# Altium project BT_STATUS_BOARD.PrjPcb
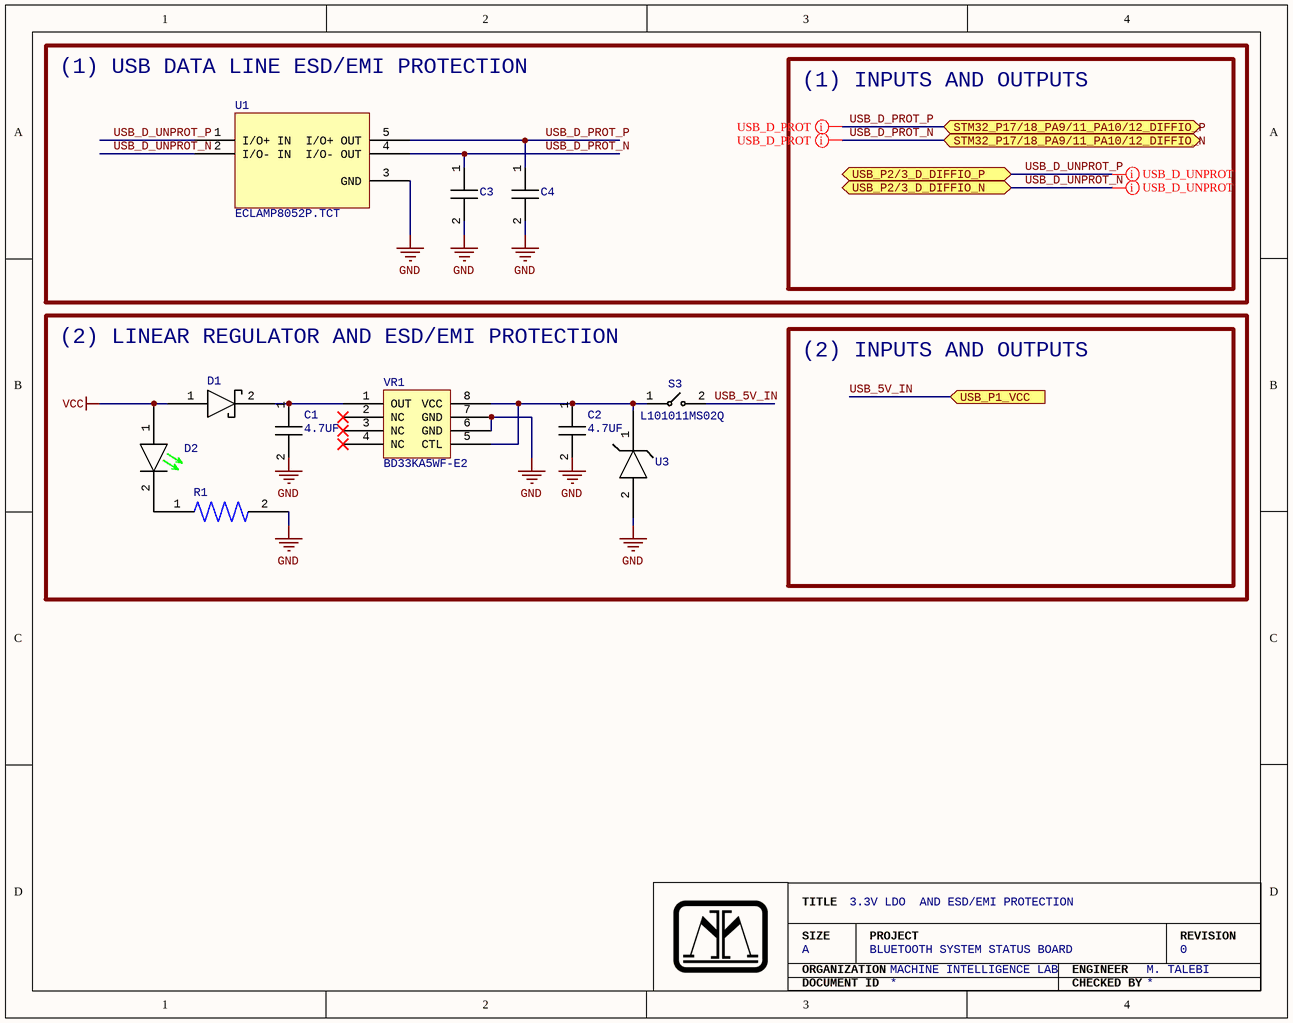
[diagram p0: S1 - POWER.SchDoc]
5 sheets, 41 parts. Net scope: flat (ports and power ports of the same name join across sheets).
Board file: P1 - PCB.PcbDoc
Sheets:
  S1 - POWER.SchDoc
  S2 - SWITCHES.SchDoc
  S3 - CONNECTORS.SchDoc
  S4 - MICROCONTROLLER.SchDoc
  S5 - BLUETOOTH.SchDoc

## Sheet S1 - POWER.SchDoc: 3.3V LDO  AND ESD/EMI PROTECTION
size A; PROJECT_NAME: BLUETOOTH STATUS BOARD; SHEET_TITLE: POWER MANAGEMENT SUBSYSTEMS; SIZE: A; DOCUMENT_ID: MIL-2021-ELEC-BTSTAT; CHECKED_BY: A. KUZMICKI; Parameter 1: 0; FIELD_1: BT BOARD POWER SUBSYSTEM; FIELD_2: A; FIELD_3: BLUETOOTH STATUS BOARD; FIELD_4: 0; FIELD_5: MACHINE INTELLIGENCE LAB; FIELD_6: M. TALEBI; FIELD_7: MIL-ELECTRICAL; FIELD_8: A. KUZMICKI; Engineer: M. TALEBI; Organization: MACHINE INTELLIGENCE LAB; Revision: 0; Project: BLUETOOTH SYSTEM STATUS BOARD

### Parts
C1  4.7UF  [TMK212AB7475KG-T]
C2  4.7UF  [TMK212AB7475KG-T]
C3  CC0603JRNPO8BN470  [CC0603JRNPO8BN470]  (value not drawn)
C4  CC0603JRNPO8BN470  [CC0603JRNPO8BN470]  (value not drawn)
D1  NRVB120VLSFT1G  [SODFL360X98-2N]  (value not drawn)
D2  151031VS06000  [151031VS06000]  (value not drawn)
R1  Y162440R0000B9R  [Y162440R0000B9R]  (value not drawn)
S3  L101011MS02Q  [L101011MS02Q]
U1  ECLAMP8052P.TCT  [ECLAMP8052P.TCT]
U3  UCLAMP0571P.TNT  [UCLAMP0571P.TNT]  (value not drawn)
VR1  BD33KA5WF-E2  [BD33KA5WF-E2]

### Ports
STM32_P17/18_PA9/11_PA10/12_DIFFIO_N (bidir), STM32_P17/18_PA9/11_PA10/12_DIFFIO_P (bidir), USB_P1_VCC (in), USB_P2/3_D_DIFFIO_N (bidir), USB_P2/3_D_DIFFIO_P (bidir)

### Nets
GND: C1.2 C2.2 C3.2 C4.2 R1.2 U1.3(GND) U3.2 VR1.6(GND) VR1.7(GND)
VCC: D1.1(-) D2.1(-)
USB_5V_IN: S3.2 ; port USB_P1_VCC
USB_D_PROT_N: C3.1 U1.4(I/O-_OUT) ; port STM32_P17/18_PA9/11_PA10/12_DIFFIO_N
USB_D_PROT_P: C4.1 U1.5(I/O+_OUT) ; port STM32_P17/18_PA9/11_PA10/12_DIFFIO_P
USB_D_UNPROT_N: U1.2(I/O-_IN) ; port USB_P2/3_D_DIFFIO_N
USB_D_UNPROT_P: U1.1(I/O+_IN) ; port USB_P2/3_D_DIFFIO_P
NetC1_1: C1.1 D1.2(+) VR1.1(OUT)
NetC2_1: C2.1 S3.1 U3.1 VR1.5(CTL) VR1.8(VCC)
NetD2_2: D2.2(+) R1.1

Not connected (* = marked no-connect by the designer): VR1 2(NC)* 3(NC)* 4(NC)*

### Layout directives
differential pair: USB_D_PROT_N, USB_D_PROT_P, USB_D_UNPROT_N, USB_D_UNPROT_P

### Notes on the sheet
- (1) USB DATA LINE ESD/EMI PROTECTION
- (1) INPUTS AND OUTPUTS
- (2) LINEAR REGULATOR AND ESD/EMI PROTECTION
- (2) INPUTS AND OUTPUTS
- TITLE
- SIZE
- ORGANIZATION
- A
- PROJECT
- ENGINEER
- REVISION
- DOCUMENT ID
- CHECKED BY

### Library data of the parts
C1 C2 = TMK212AB7475KG-T: CAP CER 4.7UF 25V X7R 0805; Tolerance: ±10%; Capacitance: 4.7 µF; Voltage - Rated: 25V; Temperature Coefficient: X7R; Operating Temperature: -55°C ~ 125°C; Applications: SMPS Filtering; Mounting Type: Surface Mount, MLCC; Package / Case: 0805 (2012 Metric); Size / Dimension: 0.079" L x 0.049" W (2.00mm x 1.25mm); Thickness (Max): 0.053" (1.35mm); ComponentLink1Description: Datasheet; ComponentLink1URL: https://www.yuden.co.jp/productdata/catalog/mlcc06_e.pdf; Supplier 1: Digi-Key; Supplier Part Number 1: 587-2990-1-ND
C3 C4 = CC0603JRNPO8BN470: CAP CER 47PF 25V NPO 0603; Tolerance: ±5%; Temperature Coefficient: C0G, NP0; Voltage - Rated: 25V; Operating Temperature: -55°C ~ 125°C; Applications: General Purpose; Mounting Type: Surface Mount, MLCC; Package / Case: 0603 (1608 Metric); Size / Dimension: 0.063" L x 0.031" W (1.60mm x 0.80mm); Thickness (Max): 0.035" (0.90mm); Capacitance: 47 pF; ComponentLink1Description: Datasheet; ComponentLink1URL: https://www.yageo.com/upload/media/product/productsearch/datasheet/mlcc/UPY-GP_NP0_16V-to-50V_18.pdf; Supplier 1: Digi-Key; Supplier Part Number 1: 311-3955-1-ND
D1 = NRVB120VLSFT1G: DIODE SCHOTTKY 20V 1A SOD123; Speed: Fast Recovery =< 500ns, > 200mA (Io); Voltage - Forward (Vf) (Max) @ If: 300 mV @ 1 A; Current - Reverse Leakage @ Vr: 15 mA @ 20 V; Diode Type: Schottky; Current - Average Rectified (Io): 1A; Mounting Type: Surface Mount; Package / Case: SOD-123F; Supplier Device Package: SOD-123FL; Operating Temperature - Junction: -65°C ~ 125°C; Voltage - DC Reverse (Vr) (Max): 20 V; Supplier 1: Future Electronics; Supplier Part Number 1: 3116510
D2 = 151031VS06000: LED GREEN DIFFUSED 3MM ROUND T/H; Configuration: Standard; Millicandela Rating: 30mcd; Lens Style: Round with Domed Top; Lens Size: 3.00mm Dia; Voltage - Forward (Vf) (Typ): 2.2V; Current - Test: 20mA; Viewing Angle: 60°; Wavelength - Dominant: 568nm; Wavelength - Peak: 560nm; Color: Green; Lens Color: Green; Lens Transparency: Diffused; Mounting Type: Through Hole; Package / Case: Radial; Supplier Device Package: 3mm Round; Height (Max): 5.55mm; Supplier 1: Digi-Key; Supplier Part Number 1: 732-5008-ND
R1 = Y162440R0000B9R: RES SMD 40 OHM 0.1% 1/5W 0805; Power (Watts): 0.2W, 1/5W; Temperature Coefficient: ±0.2ppm/°C; Resistance: 40 Ohms; Tolerance: ±0.1%; Composition: Metal Foil; Features: Moisture Resistant, Non-Inductive; Operating Temperature: -55°C ~ 150°C; Package / Case: 0805 (2012 Metric); Supplier Device Package: 0805; Size / Dimension: 0.080" L x 0.050" W (2.03mm x 1.27mm); Height - Seated (Max): 0.025" (0.64mm); Number of Terminations: 2; ComponentLink1Description: Datasheet; ComponentLink1URL: http://www.vishaypg.com/docs/63060/VSMP.pdf
S3 = L101011MS02Q: SWITCH SLIDE SPST 4A 125V; Contact Timing: Not Specified; Switch Function: On-Off; Current Rating (Amps): 4A (AC/DC); Actuator Type: Standard; Actuator Length: 5.08mm; Actuator Material: Polyamide (PA66), Nylon 6/6; Switch Travel: 3.81mm; Electrical Life: 10,000 Cycles; Voltage Rating - DC: 28 V; Circuit: SPST; Contact Material: Copper; Contact Finish: Silver; Mounting Type: Through Hole; Termination Style: PC Pin; Operating Temperature: -30°C ~ 65°C; Voltage Rating - AC: 125 V; ComponentLink1Description: Datasheet; ComponentLink1URL: https://www.ckswitches.com/media/1423/l.pdf; Supplier 1: Digi-Key; Supplier Part Number 1: CKC5106-ND
U1 = ECLAMP8052P.TCT: CMC 2LN SMD ESD AEC-Q100; Number of Lines: 2; DC Resistance (DCR) (Max): 1.8Ohm; Operating Temperature: -40°C ~ 125°C; Ratings: AEC-Q100; Features: ESD; Mounting Type: Surface Mount; Size / Dimension: 0.075" L x 0.067" W (1.90mm x 1.70mm); Height (Max): 0.024" (0.60mm); Package / Case: 5-UFDFN; ComponentLink1Description: Datasheet; ComponentLink1URL: https://semtech.my.salesforce.com/sfc/p/#E0000000JelG/a/44000000MClt/x4_O.M8f1_5l6CovuR7Nj9RxqDFB_sAgVeqN73g7pps; Supplier 1: Digi-Key; Supplier Part Number 1: ECLAMP8052P.TCTCT-ND
U3 = UCLAMP0571P.TNT: TVS DIODE 5V 15V SGP1610N2; Voltage - Reverse Standoff (Typ): 5V (Max); Voltage - Breakdown (Min): 6V; Current - Peak Pulse (10/1000µs): 80A; Power Line Protection: No; Capacitance @ Frequency: 675pF @ 1MHz; Unidirectional Channels: 1; Type: Zener; Voltage - Clamping (Max) @ Ipp: 15V; Applications: Automotive; Operating Temperature: -40°C ~ 125°C (TJ); Mounting Type: Surface Mount; Package / Case: 2-UDFN; Supplier Device Package: SGP1610N2; Supplier 1: Digi-Key; Supplier Part Number 1: UCLAMP0571P.TNTCT-ND; ComponentLink1Description: Datasheet; ComponentLink1URL: https://semtech.my.salesforce.com/sfc/p/#E0000000JelG/a/440000001MYJ/IUMjL3gSEdL0j_8aQaHuKPXW_0n5uJ8aCJSLGDAHDuk
VR1 = BD33KA5WF-E2: IC REG LINEAR 3.3V 500MA 8SOP; Output Configuration: Positive; Output Type: Fixed; Voltage - Input (Max): 5.5V; Voltage Dropout (Max): 0.2V @ 200mA; PSRR: 50dB (120Hz); Control Features: Enable; Protection Features: Over Current, Over Temperature; Number of Regulators: 1; Current - Quiescent (Iq): 550 µA; Voltage - Output (Min/Fixed): 3.3V; Current - Output: 500mA; Operating Temperature: -40°C ~ 105°C; Mounting Type: Surface Mount; Package / Case: 8-SOIC (0.173", 4.40mm Width); Supplier Device Package: 8-SOP; Current - Supply (Max): 550 µA; Supplier 1: Digi-Key; Supplier Part Number 1: BD33KA5WF-E2CT-ND

## Sheet S2 - SWITCHES.SchDoc: DEBOUNCED SWITCH CONFIGURATIONS
size A; FIELD_1: 1; FIELD_2: 2; FIELD_3: 3; FIELD_4: 4; FIELD_5: 5; FIELD_6: 6; FIELD_7: 7; FIELD_8: 8; Engineer: M. TALEBI; Organization: MACHINE INTELLIGENCE LAB; Revision: 0; Project: BLUETOOTH SYSTEM STATUS BOARD
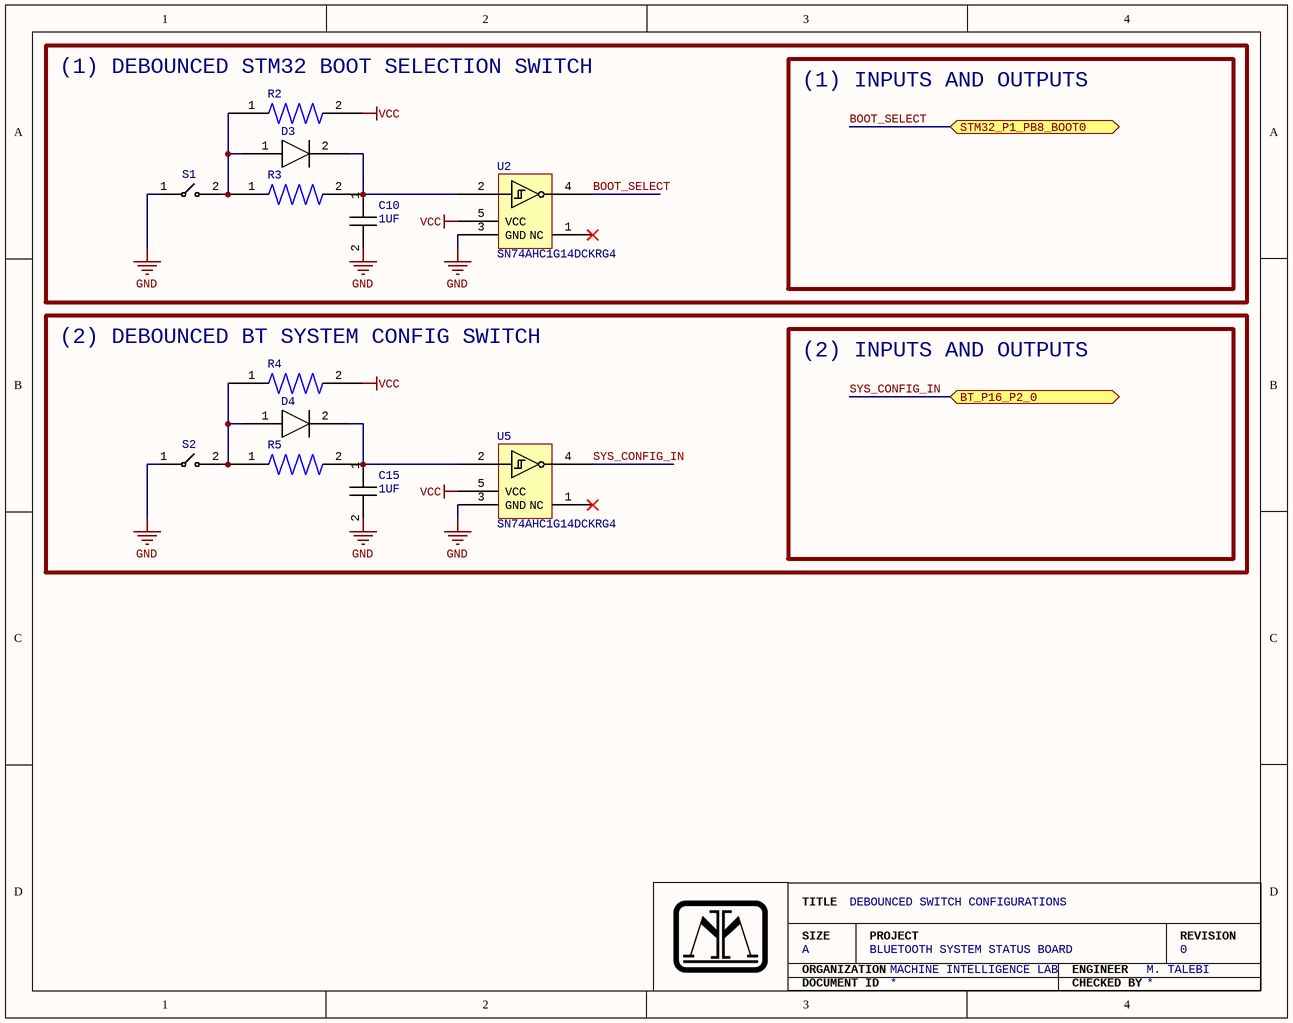
[diagram p1: S2 - SWITCHES.SchDoc]

### Parts
C10  1UF  [CL10A105KQ8NNNC]
C15  1UF  [CL10A105KQ8NNNC]
D3  RS1K-13-F  [RS1K-13-F]  (value not drawn)
D4  RS1K-13-F  [RS1K-13-F]  (value not drawn)
R2  RT1206BRD0740KL  [RT1206BRD0740KL]  (value not drawn)
R3  RT1206BRD0740KL  [RT1206BRD0740KL]  (value not drawn)
R4  RT1206BRD0740KL  [RT1206BRD0740KL]  (value not drawn)
R5  RT1206BRD0740KL  [RT1206BRD0740KL]  (value not drawn)
S1  L101011MS02Q  [L101011MS02Q]  (value not drawn)
S2  L101011MS02Q  [L101011MS02Q]  (value not drawn)
U2  SN74AHC1G14DCKRG4  [SN74AHC1G14DCKRG4]
U5  SN74AHC1G14DCKRG4  [SN74AHC1G14DCKRG4]

### Ports
BT_P16_P2_0 (bidir), STM32_P1_PB8_BOOT0 (bidir)

### Nets
GND: C10.2 C15.2 S1.1 S2.1 U2.3(GND) U5.3(GND)
VCC: R2.2 R4.2 U2.5(VCC) U5.5(VCC)
BOOT_SELECT: U2.4 ; port STM32_P1_PB8_BOOT0
SYS_CONFIG_IN: U5.4 ; port BT_P16_P2_0
NetC10_1: C10.1 D3.2(+) R3.2 U2.2
NetC15_1: C15.1 D4.2(+) R5.2 U5.2
NetD3_1: D3.1(-) R2.1 R3.1 S1.2
NetD4_1: D4.1(-) R4.1 R5.1 S2.2

Not connected (* = marked no-connect by the designer): U2 1(NC)*; U5 1(NC)*

### Notes on the sheet
- (near R2) (1) DEBOUNCED STM32 BOOT SELECTION SWITCH
- (1) INPUTS AND OUTPUTS
- (near R4) (2) DEBOUNCED BT SYSTEM CONFIG SWITCH
- (2) INPUTS AND OUTPUTS
- TITLE
- SIZE
- ORGANIZATION
- A
- PROJECT
- ENGINEER
- REVISION
- DOCUMENT ID
- CHECKED BY

### Library data of the parts
C10 C15 = CL10A105KQ8NNNC: CAP CER 1UF 6.3V X5R 0603; Tolerance: ±10%; Capacitance: 1 µF; Voltage - Rated: 6.3V; Temperature Coefficient: X5R; Operating Temperature: -55°C ~ 85°C; Applications: General Purpose; Mounting Type: Surface Mount, MLCC; Package / Case: 0603 (1608 Metric); Size / Dimension: 0.063" L x 0.031" W (1.60mm x 0.80mm); Thickness (Max): 0.035" (0.90mm); Supplier 1: Digi-Key; Supplier Part Number 1: 1276-1036-1-ND; ComponentLink1Description: Datasheet; ComponentLink1URL: https://www.samsungsem.com/resources/file/global/support/product_catalog/MLCC.pdf
D3 D4 = RS1K-13-F: DIODE GEN PURP 800V 1A SMA; Diode Type: Standard; Speed: Fast Recovery =< 500ns, > 200mA (Io); Capacitance @ Vr, F: 15pF @ 4V, 1MHz; Reverse Recovery Time (trr): 500 ns; Voltage - Forward (Vf) (Max) @ If: 1.3 V @ 1 A; Current - Reverse Leakage @ Vr: 5 µA @ 800 V; Current - Average Rectified (Io): 1A; Mounting Type: Surface Mount; Package / Case: DO-214AC, SMA; Supplier Device Package: SMA; Operating Temperature - Junction: -65°C ~ 150°C; Voltage - DC Reverse (Vr) (Max): 800 V; ComponentLink1Description: Datasheet; ComponentLink1URL: https://www.diodes.com/assets/Datasheets/ds15002.pdf
R2-R5 = RT1206BRD0740KL: RES SMD 40K OHM 0.1% 1/4W 1206; Power (Watts): 0.25W, 1/4W; Temperature Coefficient: ±25ppm/°C; Resistance: 40 kOhms; Tolerance: ±0.1%; Composition: Thin Film; Operating Temperature: -55°C ~ 155°C; Package / Case: 1206 (3216 Metric); Supplier Device Package: 1206; Size / Dimension: 0.122" L x 0.063" W (3.10mm x 1.60mm); Height - Seated (Max): 0.026" (0.65mm); Number of Terminations: 2; ComponentLink1Description: Datasheet; ComponentLink1URL: https://www.yageo.com/upload/media/product/productsearch/datasheet/rchip/PYu-RT_1-to-0.01_RoHS_L_12.pdf; Supplier 1: Digi-Key; Supplier Part Number 1: 13-RT1206BRD0740KLCT-ND
S1 S2 = L101011MS02Q: as S3 on sheet S1 - POWER; Circuit: SPST; Contact Material: Copper; Contact Finish: Silver; Mounting Type: Through Hole; Termination Style: PC Pin; Operating Temperature: -30°C ~ 65°C; Voltage Rating - AC: 125 V; ComponentLink1Description: Datasheet; ComponentLink1URL: https://www.ckswitches.com/media/1423/l.pdf; Supplier 1: Digi-Key; Supplier Part Number 1: CKC5106-ND
U2 U5 = SN74AHC1G14DCKRG4: IC INVERT SCHMITT 1CH 1IN SC70; Logic Type: Inverter; Number of Inputs: 1; Voltage - Supply: 2V ~ 5.5V; Current - Output High, Low: 8mA, 8mA; Logic Level - Low: 0.9V ~ 1.65V; Logic Level - High: 2.2V ~ 3.85V; Max Propagation Delay @ V, Max CL: 10.6ns @ 5V, 50pF; Current - Quiescent (Max): 1 µA; Features: Schmitt Trigger; Operating Temperature: -40°C ~ 125°C; Mounting Type: Surface Mount; Supplier Device Package: SC-70-5; Package / Case: 5-TSSOP, SC-70-5, SOT-353; Number of Circuits: 1

## Sheet S3 - CONNECTORS.SchDoc: CONNECTORS AND HEADERS
size A; FIELD_1: 1; FIELD_2: 2; FIELD_3: 3; FIELD_4: 4; FIELD_5: 5; FIELD_6: 6; FIELD_7: 7; FIELD_8: 8; Engineer: M. TALEBI; Organization: MACHINE INTELLIGENCE LAB; Revision: 0; Project: BLUETOOTH SYSTEM STATUS BOARD
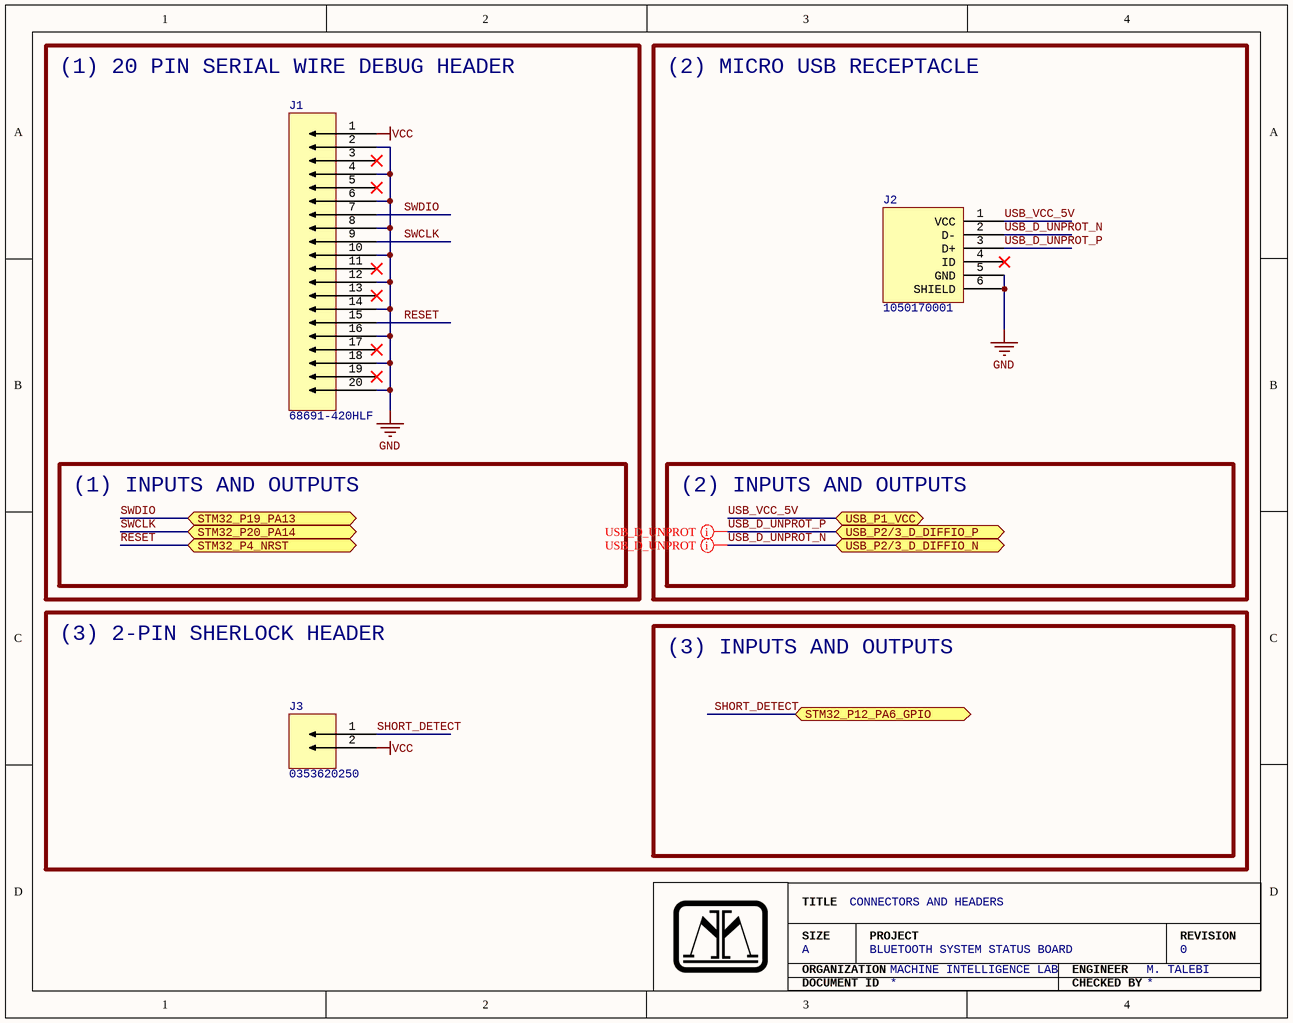
[diagram p2: S3 - CONNECTORS.SchDoc]

### Parts
J1  68691-420HLF  [68691-420HLF]
J2  1050170001  [1050170001]
J3  0353620250  [0353620250]

### Ports
STM32_P4_NRST (bidir), STM32_P12_PA6_GPIO (bidir), STM32_P19_PA13 (bidir), STM32_P20_PA14 (bidir), USB_P1_VCC (bidir), USB_P2/3_D_DIFFIO_N (bidir), USB_P2/3_D_DIFFIO_P (bidir)

### Nets
GND: J1.2 J1.4 J1.6 J1.8 J1.10 J1.12 J1.14 J1.16 J1.18 J1.20 J2.5(GND) J2.6(SHIELD)
VCC: J1.1 J3.2
RESET: J1.15 ; port STM32_P4_NRST
SHORT_DETECT: J3.1 ; port STM32_P12_PA6_GPIO
SWCLK: J1.9 ; port STM32_P20_PA14
SWDIO: J1.7 ; port STM32_P19_PA13
USB_D_UNPROT_N: J2.2(D-) ; port USB_P2/3_D_DIFFIO_N
USB_D_UNPROT_P: J2.3(D+) ; port USB_P2/3_D_DIFFIO_P
USB_VCC_5V: J2.1(VCC) ; port USB_P1_VCC  [project net USB_5V_IN]

Not connected (* = marked no-connect by the designer): J1 3(36)* 5(38)* 11(44)* 13(46)* 17(50)* 19(52)*; J2 4(ID)*

### Layout directives
differential pair: USB_D_UNPROT_N, USB_D_UNPROT_P

### Notes on the sheet
- (1) 20 PIN SERIAL WIRE DEBUG HEADER
- (2) MICRO USB RECEPTACLE
- (1) INPUTS AND OUTPUTS
- (2) INPUTS AND OUTPUTS
- (3) 2-PIN SHERLOCK HEADER
- (3) INPUTS AND OUTPUTS
- TITLE
- SIZE
- ORGANIZATION
- A
- PROJECT
- ENGINEER
- REVISION
- DOCUMENT ID
- CHECKED BY

### Library data of the parts
J1 = 68691-420HLF: CONN HEADER VERT 20POS 2.54MM; Pitch - Mating: 0.100" (2.54mm); Number of Positions: 20; Number of Positions Loaded: All; Style: Board to Board; Shrouding: Unshrouded; Contact Length - Mating: 0.318" (8.08mm); Contact Length - Post: 0.120" (3.05mm); Overall Contact Length: 0.538" (13.67mm); Material Flammability Rating: UL94 V-0; Connector Type: Header; Contact Type: Male Pin; Number of Rows: 2; Row Spacing - Mating: 0.100" (2.54mm); Mounting Type: Through Hole; Termination: Solder; Fastening Type: Push-Pull; Insulation Height: 0.100" (2.54mm); Contact Shape: Square; Contact Finish - Mating: Tin; Contact Finish Thickness - Mating: 100.0µin (2.54µm); Contact Finish - Post: Tin; Contact Material: Phosphor Bronze; Insulation Color: Black; Supplier 1: Digi-Key; Supplier Part Number 1: 609-6378-ND
J2 = 1050170001: CONN RCPT USB2.0 MICRO B SMD R/A; Connector Type: USB - micro B; Number of Contacts: 5; Gender: Receptacle; Current Rating (Amps): 1A, 1.8A; Voltage - Rated: 30VAC; Mating Cycles: 10000; Shielding: Shielded; Material Flammability Rating: UL94 V-0; Number of Ports: 1; Specifications: USB 2.0; Mounting Type: Surface Mount, Right Angle; Through Hole; Mounting Feature: Horizontal; Termination: Solder; Features: Pick and Place, Solder Retention; Operating Temperature: -30°C ~ 85°C; Contact Finish: Gold; Shell/Shielding Material: Steel, Stainless; Insulation Color: Black; Supplier 1: Digi-Key; Supplier Part Number 1: WM1399CT-ND
J3 = 0353620250: CONN HEADER VERT 2POS 2MM; Pitch - Mating: 0.079" (2.00mm); Number of Positions: 2; Number of Positions Loaded: All; Style: Board to Cable/Wire; Shrouding: Shrouded - 4 Wall; Contact Length - Mating: 0.145" (3.70mm); Contact Length - Post: 0.130" (3.30mm); Material Flammability Rating: UL94 V-0; Voltage Rating: 125V; Mated Stacking Heights: 8.5mm; Connector Type: Header; Contact Type: Male Pin; Number of Rows: 1; Mounting Type: Through Hole; Termination: Solder; Fastening Type: Locking Ramp; Insulation Height: 0.335" (8.51mm); Contact Shape: Square; Contact Finish - Mating: Tin; Contact Finish Thickness - Mating: 39.4µin (1.00µm); Contact Finish - Post: Tin; Contact Material: Brass; Insulation Material: Polyamide (PA), Nylon; Operating Temperature: -40°C ~ 105°C; Insulation Color: Natural; Contact Finish Thickness - Post: 39.4µin (1.00µm); Applications: Automotive, General Purpose; ComponentLink1Description: Datasheet; ComponentLink1URL: https://media.digikey.com/pdf/Data%20Sheets/Molex%20PDFs/PS-35507-003.pdf

## Sheet S4 - MICROCONTROLLER.SchDoc: STM32 MCU
size A; FIELD_1: 1; FIELD_2: 2; FIELD_3: 3; FIELD_4: 4; FIELD_5: 5; FIELD_6: 6; FIELD_7: 7; FIELD_8: 8; Engineer: M. TALEBI; Organization: MACHINE INTELLIGENCE LAB; Revision: 0; Project: BLUETOOTH SYSTEM STATUS BOARD
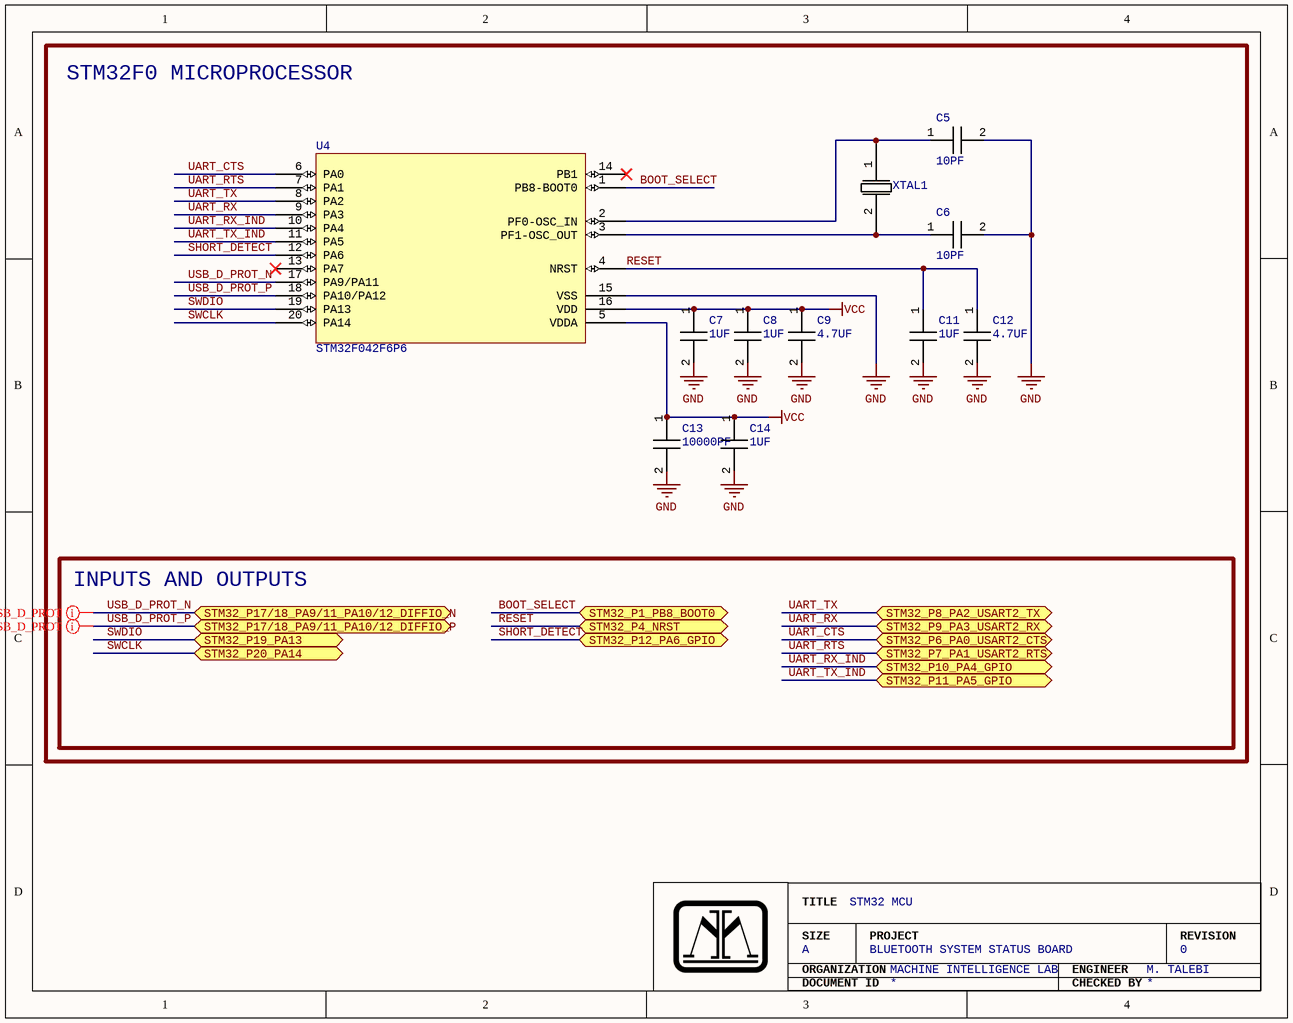
[diagram p3: S4 - MICROCONTROLLER.SchDoc]

### Parts
C5  10PF  [C0603C0G1E100D030BA]
C6  10PF  [C0603C0G1E100D030BA]
C7  1UF  [CL10A105KQ8NNNC]
C8  1UF  [CL10A105KQ8NNNC]
C9  4.7UF  [TMK212AB7475KG-T]
C11  1UF  [CL10A105KQ8NNNC]
C12  4.7UF  [TMK212AB7475KG-T]
C13  10000PF  [C1005X7R1C103K050BA]
C14  1UF  [CL10A105KQ8NNNC]
U4  STM32F042F6P6  [STM32F042F6P6]
XTAL1  ECS-80-20-5PX-TR  [ECS-80-20-5PX-TR]  (value not drawn)

### Ports
STM32_P1_PB8_BOOT0 (bidir), STM32_P4_NRST (bidir), STM32_P6_PA0_USART2_CTS (bidir), STM32_P7_PA1_USART2_RTS (bidir), STM32_P8_PA2_USART2_TX (bidir), STM32_P9_PA3_USART2_RX (bidir), STM32_P10_PA4_GPIO (bidir), STM32_P11_PA5_GPIO (bidir), STM32_P12_PA6_GPIO (bidir), STM32_P17/18_PA9/11_PA10/12_DIFFIO_N (bidir), STM32_P17/18_PA9/11_PA10/12_DIFFIO_P (bidir), STM32_P19_PA13 (bidir), STM32_P20_PA14 (bidir)

### Nets
GND: C5.2 C6.2 C7.2 C8.2 C9.2 C11.2 C12.2 C13.2 C14.2 U4.15(VSS)
VCC: C7.1 C8.1 C9.1 C13.1 C14.1 U4.5(VDDA) U4.16(VDD)
BOOT_SELECT: U4.1(PB8-BOOT0) ; port STM32_P1_PB8_BOOT0
RESET: C11.1 C12.1 U4.4(NRST) ; port STM32_P4_NRST
SHORT_DETECT: U4.12(PA6) ; port STM32_P12_PA6_GPIO
SWCLK: U4.20(PA14) ; port STM32_P20_PA14
SWDIO: U4.19(PA13) ; port STM32_P19_PA13
UART_CTS: U4.6(PA0) ; port STM32_P6_PA0_USART2_CTS
UART_RTS: U4.7(PA1) ; port STM32_P7_PA1_USART2_RTS
UART_RX: U4.9(PA3) ; port STM32_P9_PA3_USART2_RX
UART_RX_IND: U4.10(PA4) ; port STM32_P10_PA4_GPIO
UART_TX: U4.8(PA2) ; port STM32_P8_PA2_USART2_TX
UART_TX_IND: U4.11(PA5) ; port STM32_P11_PA5_GPIO
USB_D_PROT_N: U4.17(PA9/PA11) ; port STM32_P17/18_PA9/11_PA10/12_DIFFIO_N
USB_D_PROT_P: U4.18(PA10/PA12) ; port STM32_P17/18_PA9/11_PA10/12_DIFFIO_P
NetC5_1: C5.1 U4.2(PF0-OSC_IN) XTAL1.1
NetC6_1: C6.1 U4.3(PF1-OSC_OUT) XTAL1.2

Not connected (* = marked no-connect by the designer): U4 13(PA7)* 14(PB1)*

### Layout directives
differential pair: USB_D_PROT_N, USB_D_PROT_P

### Notes on the sheet
- STM32F0 MICROPROCESSOR
- INPUTS AND OUTPUTS
- TITLE
- SIZE
- ORGANIZATION
- A
- PROJECT
- ENGINEER
- REVISION
- DOCUMENT ID
- CHECKED BY

### Library data of the parts
C5 C6 = C0603C0G1E100D030BA: CAP CER 10PF 25V C0G 0201; Tolerance: ±0.5pF; Temperature Coefficient: C0G, NP0; Voltage - Rated: 25V; Operating Temperature: -55°C ~ 125°C; Features: Low ESL; Applications: General Purpose; Mounting Type: Surface Mount, MLCC; Package / Case: 0201 (0603 Metric); Size / Dimension: 0.024" L x 0.012" W (0.60mm x 0.30mm); Thickness (Max): 0.013" (0.33mm); Capacitance: 10 pF; ComponentLink1Description: Datasheet; ComponentLink1URL: https://product.tdk.com/en/system/files?file=dam/doc/product/capacitor/ceramic/mlcc/catalog/mlcc_commercial_general_en.pdf; Supplier 1: Digi-Key; Supplier Part Number 1: 445-4651-1-ND
C7 C8 C11 C14 = CL10A105KQ8NNNC: as C10 on sheet S2 - SWITCHES; Voltage - Rated: 6.3V; Temperature Coefficient: X5R; Operating Temperature: -55°C ~ 85°C; Applications: General Purpose; Mounting Type: Surface Mount, MLCC; Package / Case: 0603 (1608 Metric); Size / Dimension: 0.063" L x 0.031" W (1.60mm x 0.80mm); Thickness (Max): 0.035" (0.90mm); Supplier 1: Digi-Key; Supplier Part Number 1: 1276-1036-1-ND; ComponentLink1Description: Datasheet; ComponentLink1URL: https://www.samsungsem.com/resources/file/global/support/product_catalog/MLCC.pdf
C9 C12 = TMK212AB7475KG-T: as C1 on sheet S1 - POWER; Voltage - Rated: 25V; Temperature Coefficient: X7R; Operating Temperature: -55°C ~ 125°C; Applications: SMPS Filtering; Mounting Type: Surface Mount, MLCC; Package / Case: 0805 (2012 Metric); Size / Dimension: 0.079" L x 0.049" W (2.00mm x 1.25mm); Thickness (Max): 0.053" (1.35mm); ComponentLink1Description: Datasheet; ComponentLink1URL: https://www.yuden.co.jp/productdata/catalog/mlcc06_e.pdf; Supplier 1: Digi-Key; Supplier Part Number 1: 587-2990-1-ND
C13 = C1005X7R1C103K050BA: CAP CER 10000PF 16V X7R 0402; Tolerance: ±10%; Voltage - Rated: 16V; Temperature Coefficient: X7R; Operating Temperature: -55°C ~ 125°C; Features: Low ESL; Applications: General Purpose; Mounting Type: Surface Mount, MLCC; Package / Case: 0402 (1005 Metric); Size / Dimension: 0.039" L x 0.020" W (1.00mm x 0.50mm); Thickness (Max): 0.022" (0.55mm); Capacitance: 10000 pF; ComponentLink1Description: Datasheet; ComponentLink1URL: https://product.tdk.com/en/system/files?file=dam/doc/product/capacitor/ceramic/mlcc/catalog/mlcc_commercial_general_en.pdf; Supplier 1: Digi-Key; Supplier Part Number 1: 445-1262-1-ND
U4 = STM32F042F6P6: IC MCU 32BIT 32KB FLASH 20TSSOP; Core Processor: ARM® Cortex®-M0; Speed: 48MHz; Connectivity: CANbus, HDMI-CEC, I²C, IrDA, LINbus, SPI, UART/USART, USB; Peripherals: DMA, I²S, POR, PWM, WDT; Program Memory Size: 32KB (32K x 8); RAM Size: 6K x 8; Voltage - Supply (Vcc/Vdd): 1.65V ~ 3.6V; Data Converters: A/D 12x12b; Oscillator Type: Internal; Number of I/O: 16; Core Size: 32-Bit; Supplier Part Number 1: 42Y1015; Program Memory Type: FLASH; Operating Temperature: -40°C ~ 85°C (TA); Mounting Type: Surface Mount; Package / Case: 20-TSSOP (0.173", 4.40mm Width); Supplier Device Package: 20-TSSOP; Supplier 1: Newark; ComponentLink1Description: Datasheet; ComponentLink1URL: https://www.st.com/content/ccc/resource/technical/document/datasheet/52/ad/d0/80/e6/be/40/ad/DM00105814.pdf/files/DM00105814.pdf/jcr:content/translations/en.DM00105814.pdf
XTAL1 = ECS-80-20-5PX-TR: CRYSTAL 8.0000MHZ 20PF SMD; Frequency Stability: ±50ppm; Frequency Tolerance: ±30ppm; Operating Mode: Fundamental; Frequency: 8 MHz; ESR (Equivalent Series Resistance): 60 Ohms; Type: MHz Crystal; Load Capacitance: 20pF; Operating Temperature: -10°C ~ 70°C; Mounting Type: Surface Mount; Package / Case: HC-49/US; Size / Dimension: 0.449" L x 0.189" W (11.40mm x 4.80mm); Height - Seated (Max): 0.169" (4.30mm); ComponentLink1Description: Datasheet; ComponentLink1URL: https://ecsxtal.com/store/pdf/csm-7x.pdf

## Sheet S5 - BLUETOOTH.SchDoc: BLUETOOTH MODULE
size A; FIELD_1: 1; FIELD_2: 2; FIELD_3: 3; FIELD_4: 4; FIELD_5: 5; FIELD_6: 6; FIELD_7: 7; FIELD_8: 8; Engineer: M. TALEBI; Organization: MACHINE INTELLIGENCE LAB; Revision: 0; Project: BLUETOOTH SYSTEM STATUS BOARD
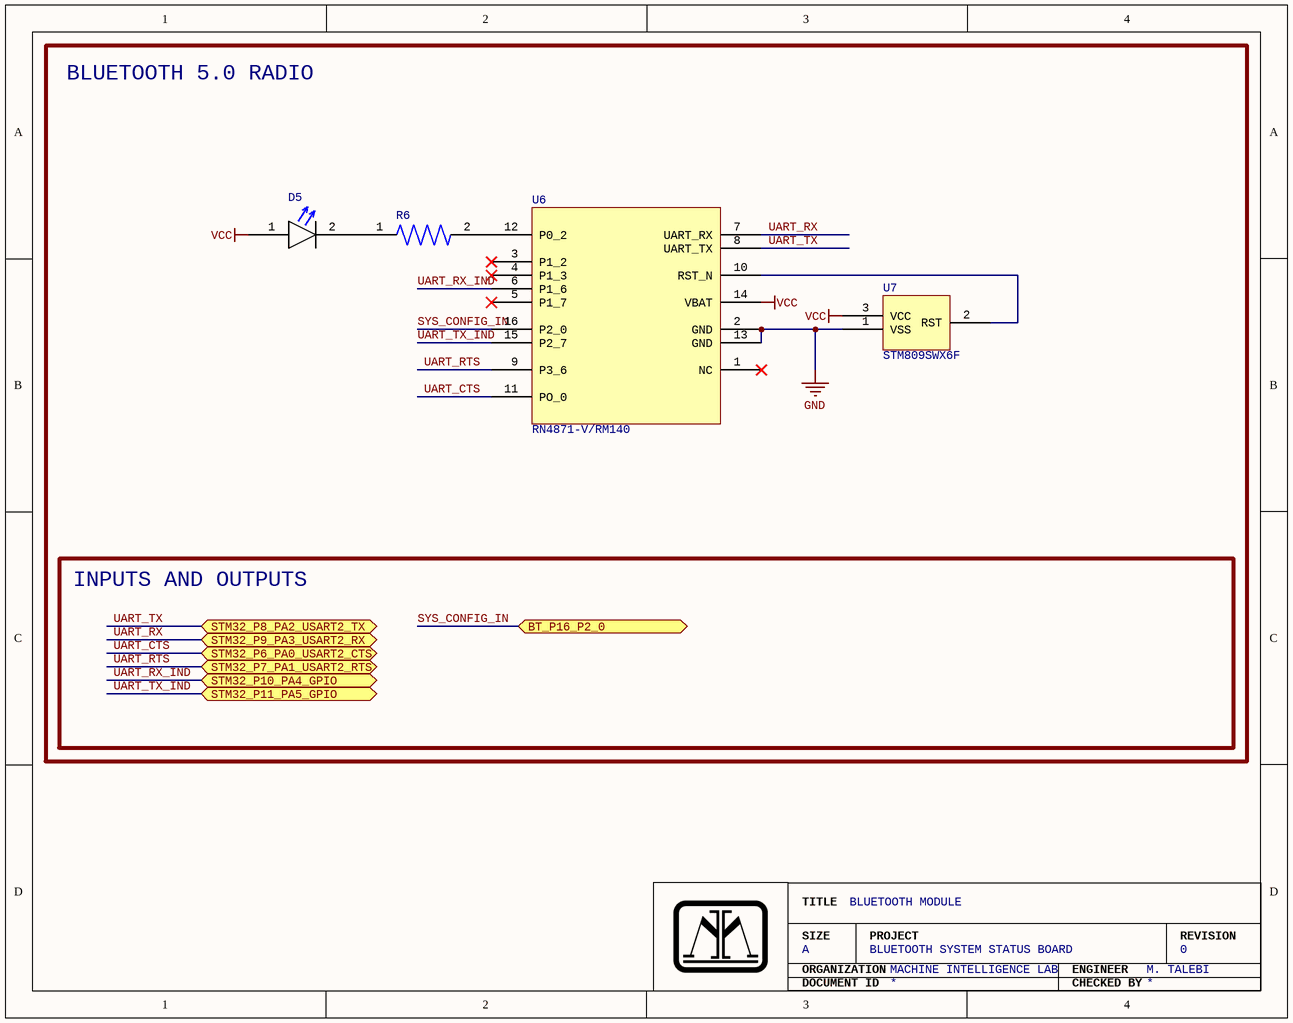
[diagram p4: S5 - BLUETOOTH.SchDoc]

### Parts
D5  SLR343BC4T3F  [SLR343BC4T3F]  (value not drawn)
R6  CRCW0201330RFKED  [CRCW0201330RFKED]  (value not drawn)
U6  RN4871-V/RM140  [RN4871-V/RM140]
U7  STM809SWX6F  [STM809SWX6F]

### Ports
BT_P16_P2_0 (bidir), STM32_P6_PA0_USART2_CTS (bidir), STM32_P7_PA1_USART2_RTS (bidir), STM32_P8_PA2_USART2_TX (bidir), STM32_P9_PA3_USART2_RX (bidir), STM32_P10_PA4_GPIO (bidir), STM32_P11_PA5_GPIO (bidir)

### Nets
GND: U6.2(GND) U6.13(GND) U7.1(VSS)
VCC: D5.1(-) U6.14(VBAT) U7.3(VCC)
SYS_CONFIG_IN: U6.16(P2_0) ; port BT_P16_P2_0
UART_CTS: U6.11(PO_0) ; port STM32_P6_PA0_USART2_CTS
UART_RTS: U6.9(P3_6) ; port STM32_P7_PA1_USART2_RTS
UART_RX: U6.7(UART_RX) ; port STM32_P9_PA3_USART2_RX
UART_RX_IND: U6.6(P1_6) ; port STM32_P10_PA4_GPIO
UART_TX: U6.8(UART_TX) ; port STM32_P8_PA2_USART2_TX
UART_TX_IND: U6.15(P2_7) ; port STM32_P11_PA5_GPIO
NetD5_2: D5.2(+) R6.1
NetR6_2: R6.2 U6.12(P0_2)
NetU6_10: U6.10(RST_N) U7.2(RST)

Not connected (* = marked no-connect by the designer): U6 1(NC)* 3(P1_2)* 4(P1_3)* 5(P1_7)*

### Notes on the sheet
- BLUETOOTH 5.0 RADIO
- INPUTS AND OUTPUTS
- TITLE
- SIZE
- ORGANIZATION
- A
- PROJECT
- ENGINEER
- REVISION
- DOCUMENT ID
- CHECKED BY

### Library data of the parts
D5 = SLR343BC4T3F: LED BLUE CLEAR T-1 T/H; Configuration: Standard; Lens Color: Colorless; Millicandela Rating: 470mcd; Lens Style: Round with Domed Top; Lens Size: 3.10mm Dia; Voltage - Forward (Vf) (Typ): 3.2V; Current - Test: 20mA; Viewing Angle: 40°; Wavelength - Dominant: 470nm; Color: Blue; Lens Transparency: Clear; Mounting Type: Through Hole; Package / Case: Radial; Supplier Device Package: T-1; Height (Max): 5.60mm; Supplier 1: Digi-Key; Supplier Part Number 1: 846-1137-ND
R6 = CRCW0201330RFKED: RES SMD 330 OHM 1% 1/20W 0201; Power (Watts): 0.05W, 1/20W; Temperature Coefficient: ±100ppm/°C; Resistance: 330 Ohms; Tolerance: ±1%; Composition: Thick Film; Operating Temperature: -55°C ~ 155°C; Package / Case: 0201 (0603 Metric); Supplier Device Package: 0201; Size / Dimension: 0.024" L x 0.012" W (0.60mm x 0.30mm); Height - Seated (Max): 0.011" (0.28mm); Number of Terminations: 2; ComponentLink1Description: Datasheet; ComponentLink1URL: https://www.vishay.com/docs/20052/crcw0201e3.pdf
U6 = RN4871-V/RM140: RX TXRX MODULE BLE CHIP SMD; Utilized IC / Part: RN4871; RF Family/Standard: Bluetooth; Protocol: Bluetooth v5.0; Modulation: GFSK; Frequency: 2.402GHz ~ 2.48GHz; Data Rate: 10kbps; Power - Output: 0dBm; Sensitivity: -90dBm; Serial Interfaces: I²C, AIO, PIO, PWM, SPI, UART; Antenna Type: Integrated, Chip; Voltage - Supply: 1.9V ~ 3.6V; Current - Receiving: 13mA; Current - Transmitting: 13mA; Mounting Type: Surface Mount; Operating Temperature: -20°C ~ 70°C; Package / Case: 16-SMD Module; Supplier 1: Newark; Supplier Part Number 1: 39AH3381; ComponentLink1Description: Datasheet; ComponentLink1URL: https://ww1.microchip.com/downloads/en/DeviceDoc/RN4870-71-Data-Sheet-DS50002489E.pdf
U7 = STM809SWX6F: IC SUPERVISOR 1 CHANNEL SOT23-3; Voltage - Threshold: 2.93V; Output: Push-Pull, Totem Pole; Reset: Active Low; Reset Timeout: 140ms Minimum; Number of Voltages Monitored: 1; Type: Simple Reset/Power-On Reset; Operating Temperature: -40°C ~ 85°C (TA); Mounting Type: Surface Mount; Package / Case: TO-236-3, SC-59, SOT-23-3; Supplier Device Package: SOT-23-3; ComponentLink1Description: Datasheet; ComponentLink1URL: https://www.st.com/content/ccc/resource/technical/document/datasheet/cd/e2/ab/27/7d/5d/44/41/CD00003591.pdf/files/CD00003591.pdf/jcr:content/translations/en.CD00003591.pdf; Supplier 1: Digi-Key; Supplier Part Number 1: 497-3338-1-ND

## Nets that join several sheets
GND: S1 - POWER (9 pins), S2 - SWITCHES (6 pins), S3 - CONNECTORS (12 pins), S4 - MICROCONTROLLER (10 pins), S5 - BLUETOOTH (U6.2 U6.13 U7.1)
VCC: S1 - POWER (D1.1 D2.1), S2 - SWITCHES (R2.2 R4.2 U2.5 U5.5), S3 - CONNECTORS (J1.1 J3.2), S4 - MICROCONTROLLER (7 pins), S5 - BLUETOOTH (D5.1 U6.14 U7.3)
BOOT_SELECT: S2 - SWITCHES (U2.4), S4 - MICROCONTROLLER (U4.1)
RESET: S3 - CONNECTORS (J1.15), S4 - MICROCONTROLLER (C11.1 C12.1 U4.4)
SHORT_DETECT: S3 - CONNECTORS (J3.1), S4 - MICROCONTROLLER (U4.12)
SWCLK: S3 - CONNECTORS (J1.9), S4 - MICROCONTROLLER (U4.20)
SWDIO: S3 - CONNECTORS (J1.7), S4 - MICROCONTROLLER (U4.19)
SYS_CONFIG_IN: S2 - SWITCHES (U5.4), S5 - BLUETOOTH (U6.16)
UART_CTS: S4 - MICROCONTROLLER (U4.6), S5 - BLUETOOTH (U6.11)
UART_RTS: S4 - MICROCONTROLLER (U4.7), S5 - BLUETOOTH (U6.9)
UART_RX: S4 - MICROCONTROLLER (U4.9), S5 - BLUETOOTH (U6.7)
UART_RX_IND: S4 - MICROCONTROLLER (U4.10), S5 - BLUETOOTH (U6.6)
UART_TX: S4 - MICROCONTROLLER (U4.8), S5 - BLUETOOTH (U6.8)
UART_TX_IND: S4 - MICROCONTROLLER (U4.11), S5 - BLUETOOTH (U6.15)
USB_5V_IN: S1 - POWER (S3.2), S3 - CONNECTORS (J2.1)
USB_D_PROT_N: S1 - POWER (C3.1 U1.4), S4 - MICROCONTROLLER (U4.17)
USB_D_PROT_P: S1 - POWER (C4.1 U1.5), S4 - MICROCONTROLLER (U4.18)
USB_D_UNPROT_N: S1 - POWER (U1.2), S3 - CONNECTORS (J2.2)
USB_D_UNPROT_P: S1 - POWER (U1.1), S3 - CONNECTORS (J2.3)